# EAGLE design ESP8266-01 Solid State Relay 2016-01-18 (EAGLE 7.4.0)
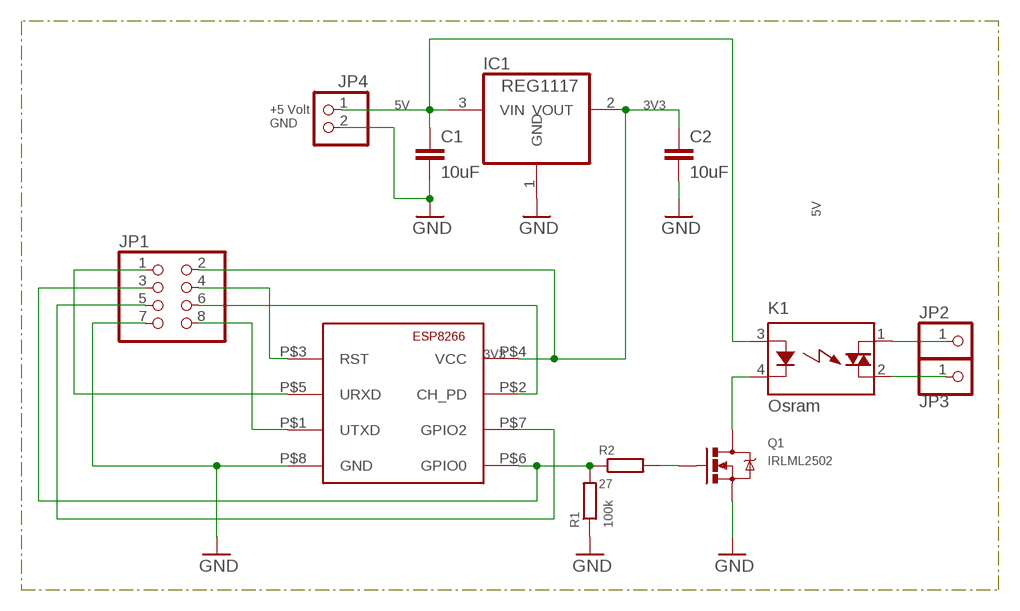
[diagram p0: schematic, sheet 1]

## Parts
C1  10uF  C-EUC1206  [C1206]
C2  10uF  C-EUC1206  [C1206]
IC1  REG1117  [SOT223]
JP1  PINHD-2X4  [2X04]
JP2  PINHD-1X1  [1X01]
JP3  PINHD-1X1  [1X01]
JP4  PINHD-1X2  [1X02]
K1  Osram  S202SE1  [S2XXEX]
Q1  IRLML2502  MOSFET-NCHANNELAO3404A  [SOT23-3]
R1  100k  R-EU_R0805  [R0805]
R2  27  R-EU_R0805  [R0805]
U$1  ESP8266-01  [ESP-01]

## Nets
3V3: C2.1 IC1.2(VOUT) JP1.2 U$1.P$4(VCC)
5V: C1.1 IC1.3(VIN) JP4.1 K1.3(A)
GND: C1.2 C2.2 IC1.1(GND) JP1.7 JP4.2 Q1.2(S) R1.1 U$1.P$8(GND)
N$1: Q1.1(G) R2.2
N$2: JP1.4 U$1.P$3(RST)
N$3: K1.4(K) Q1.3(D)
N$4: JP3.1 K1.2(DS2)
N$5: JP1.6 U$1.P$2(CH_PD)
N$6: JP1.8 U$1.P$1(UTXD)
N$7: JP1.1 U$1.P$5(URXD)
N$8: JP1.3 R1.2 R2.1 U$1.P$6(GPIO0)
N$9: JP1.5 U$1.P$7(GPIO2)
N$10: JP2.1 K1.1(DS1)

## Notes on the sheet
- +5 Volt
  GND

## Library data of the parts
C1 C2 = rcl:C-EU: CAPACITOR, European symbol
IC1 = burr-brown:REG1117: 800mA and 1A Low Dropout (LDO) Positive Regulator 1.8V, 2.5V, 2.85V, 3.3V, 5V, and Adj; MPN: REG1117; OC_FARNELL: 1097566; OC_NEWARK: 14P6981
JP1 = pinhead:PINHD-2X4: PIN HEADER
JP2 JP3 = pinhead:PINHD-1X1: PIN HEADER
JP4 = pinhead:PINHD-1X2: PIN HEADER
K1 = relay:S2*: SIP Type SSR for Medium Power Control SHARP Source: 168149-da-01-en-Solid_State_Relais_S_202_SE1_SE2.pdf; OC_FARNELL: unknown; OC_NEWARK: unknown
Q1 = SparkFun-DiscreteSemi:MOSFET-NCHANNEL: Common NMOSFET Parts MFG P/N Store ID Prod ID FDD8780 TRANS-09984 SI7820DN TRANS-11055 FDS6630A IC-08089 2N7002PW TRANS-11151 FQP30N06L COM-10213 TRANS-10060 BSS123LT1G TRANS-08345 BSS138 TRANS-00830 BS170 2N7000; PROD_ID: TRAN-12988
R1 R2 = rcl:R-EU_: RESISTOR, European symbol
U$1 = #ESP8266:ESP8266-01: ESP8266 - ESP-01 Module

## Board
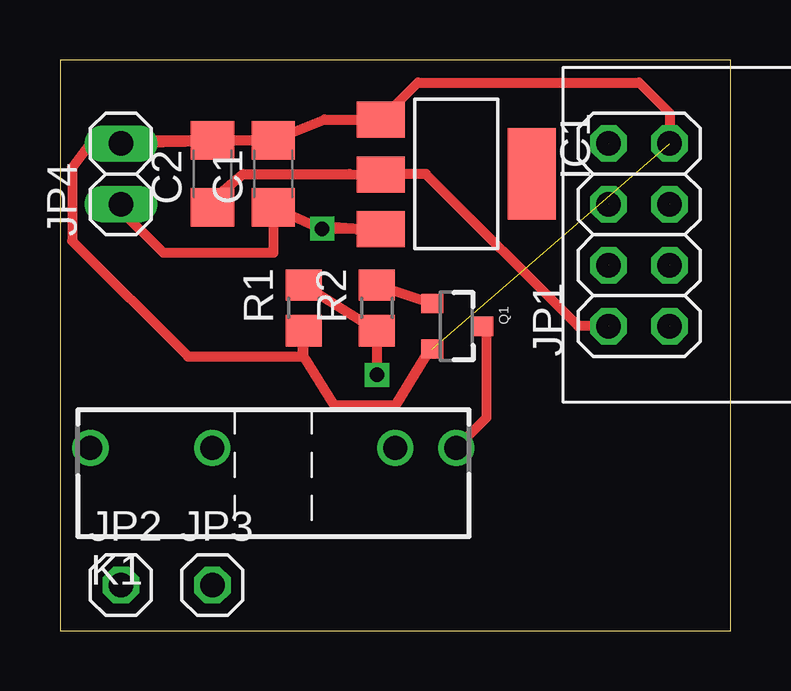
[diagram p1: board, top side]
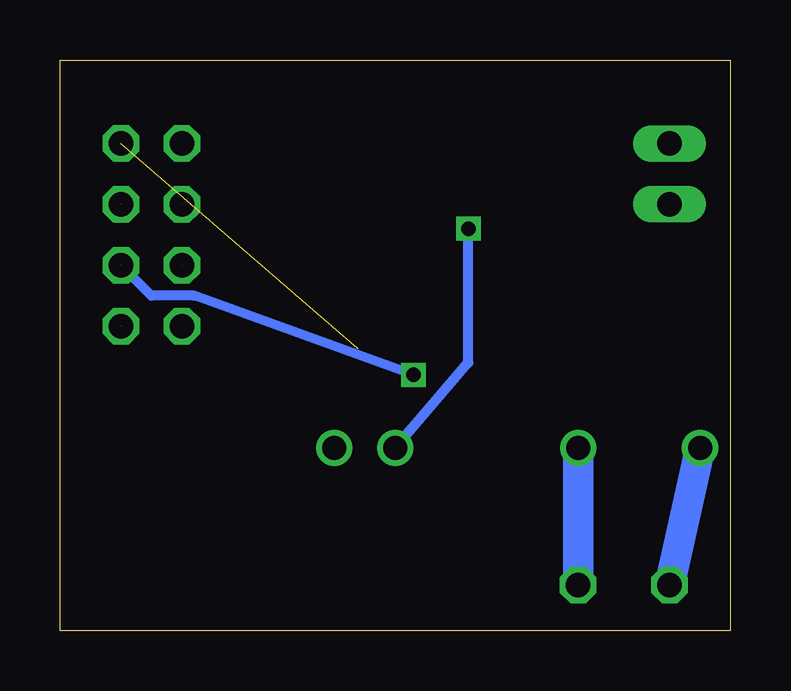
[diagram p2: board, bottom side, seen from below]

Size 27.93 x 23.8 mm. Coordinates in mm from the lower left corner, seen from the top.
Outline: 27.93,0 27.93,23.8 0,23.8 0,0 27.93,0
Copper layers (1*16): Top 0.035mm / dielectric 1.5mm / Bottom 0.035mm
Design rules "default": minimum track width 10mil, minimum drill 24mil, track to track 8mil, track to pad 8mil, pad to pad 8mil, via to via 8mil, smd to smd 8mil, copper to edge 40mil, drill to drill 8mil, minimum pad ring 10mil, minimum via ring 8mil, stop-mask expansion 4mil, vias tented up to drill 0mil, thermal gap 10mil

### Footprints (pad centres in the part's own frame; a part is rotated, then mirrored left to right if it is on the bottom)
C1206 = smd 1.6 x 1.8: 1 -1.4,0; 2 1.4,0
SOT223 = smd 1.499 x 2.007: 1 -2.261,-3.15; 2 0.025,-3.15; 3 2.311,-3.15 | smd 3.81 x 2.007: 4 0,3.15
2X04 = drill 1.016 octagon: 1 -3.81,-1.27; 2 -3.81,1.27; 3 -1.27,-1.27; 4 -1.27,1.27; 5 1.27,-1.27; 6 1.27,1.27; 7 3.81,-1.27; 8 3.81,1.27
1X01 = drill 1.016 octagon: 1 0,0
1X02 = drill 1.016 long: 1 -1.27,0; 2 1.27,0
S2XXEX = drill 1: 1 -7.62,0; 2 -2.54,0; 3 5.08,0; 4 7.62,0
SOT23-3 = smd 0.8 x 0.9: 1 -0.95,-1; 2 0.95,-1; 3 0,1.1
R0805 = smd 1.3 x 1.5: 1 -0.95,0; 2 0.95,0
ESP-01 = drill 0.8 pad 1.422: P$1 0,0; P$2 2.54,0; P$3 5.08,0; P$4 7.62,0; P$5 7.62,2.54; P$6 5.08,2.54; P$7 2.54,2.54; P$8 0,2.54

### Placement (x,y rotation side)
C1  8.88,19.05 90 top
C2  6.34,19.05 90 top
IC1  16.5,19.05 270 top
JP1  24.12,16.51 90 top
JP2  2.53,1.91 0 top
JP3  6.34,1.91 0 top
JP4  2.53,19.05 90 top
K1  8.88,7.62 0 top
Q1  16.5,12.7 270 top
R1  10.15,13.46 90 top
R2  13.2,13.46 90 top
U$1  22.85,20.32 270 top

### Tracks (layer width: path | path; a pad name or v marks a point on that pad's centre or on a via)
3V3  (1 unrouted)
  Top 0.406: C2.1 5.96,17.65 7.61,19.05 12.05,19.05 IC1.2 13.38,19.05 15.23,19.05 21.58,12.7 JP1.2
5V  (via drill 0.6)
  Top 0.406: JP4.1 2.53,17.53 4.31,15.75 8.88,15.75 C1.1 10.53,16.89 12.18,16.76 13.12,16.51 IC1.3 v10.91,16.76
  Bottom 0.406: K1.3 10.91,11.18 v10.91,16.76
GND  (1 unrouted)
  Top 0.406: JP4.2 3.93,20.45 C2.2 C1.2 | C1.2 11.01,21.31 IC1.1 14.9,22.86 24.12,22.86 25.39,21.59 JP1.7 | Q1.2 15.23,11.48 13.96,9.4 11.42,9.4 10.15,11.43 R1.1 10.08,11.43 5.32,11.43 0.5,16.26 0.5,19.3 1.26,20.32 JP4.2 | C1.2 JP4.2
N$1
  Top 0.406: Q1.1 R2.2
N$2  (1 unrouted)
N$3
  Top 0.406: K1.4 17.77,8.89 17.77,12.7 Q1.3
N$4
  Bottom 1.27: JP3.1 K1.2
N$5  (1 unrouted)
N$6  (1 unrouted)
N$7  (1 unrouted)
N$8  (via drill 0.6)  (1 unrouted)
  Top 0.406: R1.2 R2.1 v13.2,10.67
  Bottom 0.406: v13.2,10.67 22.34,13.97 24.12,13.97 JP1.3
N$9  (1 unrouted)
N$10
  Bottom 1.27: JP2.1 K1.1